# Altium project miniBackplane_SFP.PrjPCB (part 2 of 2)

## Sheet WR_LINK.SchDoc
size A3 portrait
Used 9 times, as channels U_WR_LINK, U_WR_LINK, U_WR_LINK, U_WR_LINK, U_WR_LINK, U_WR_LINK, U_WR_LINK, U_WR_LINK, U_WR_LINK. Parts and nets are listed once, with the designators drawn on the sheet.
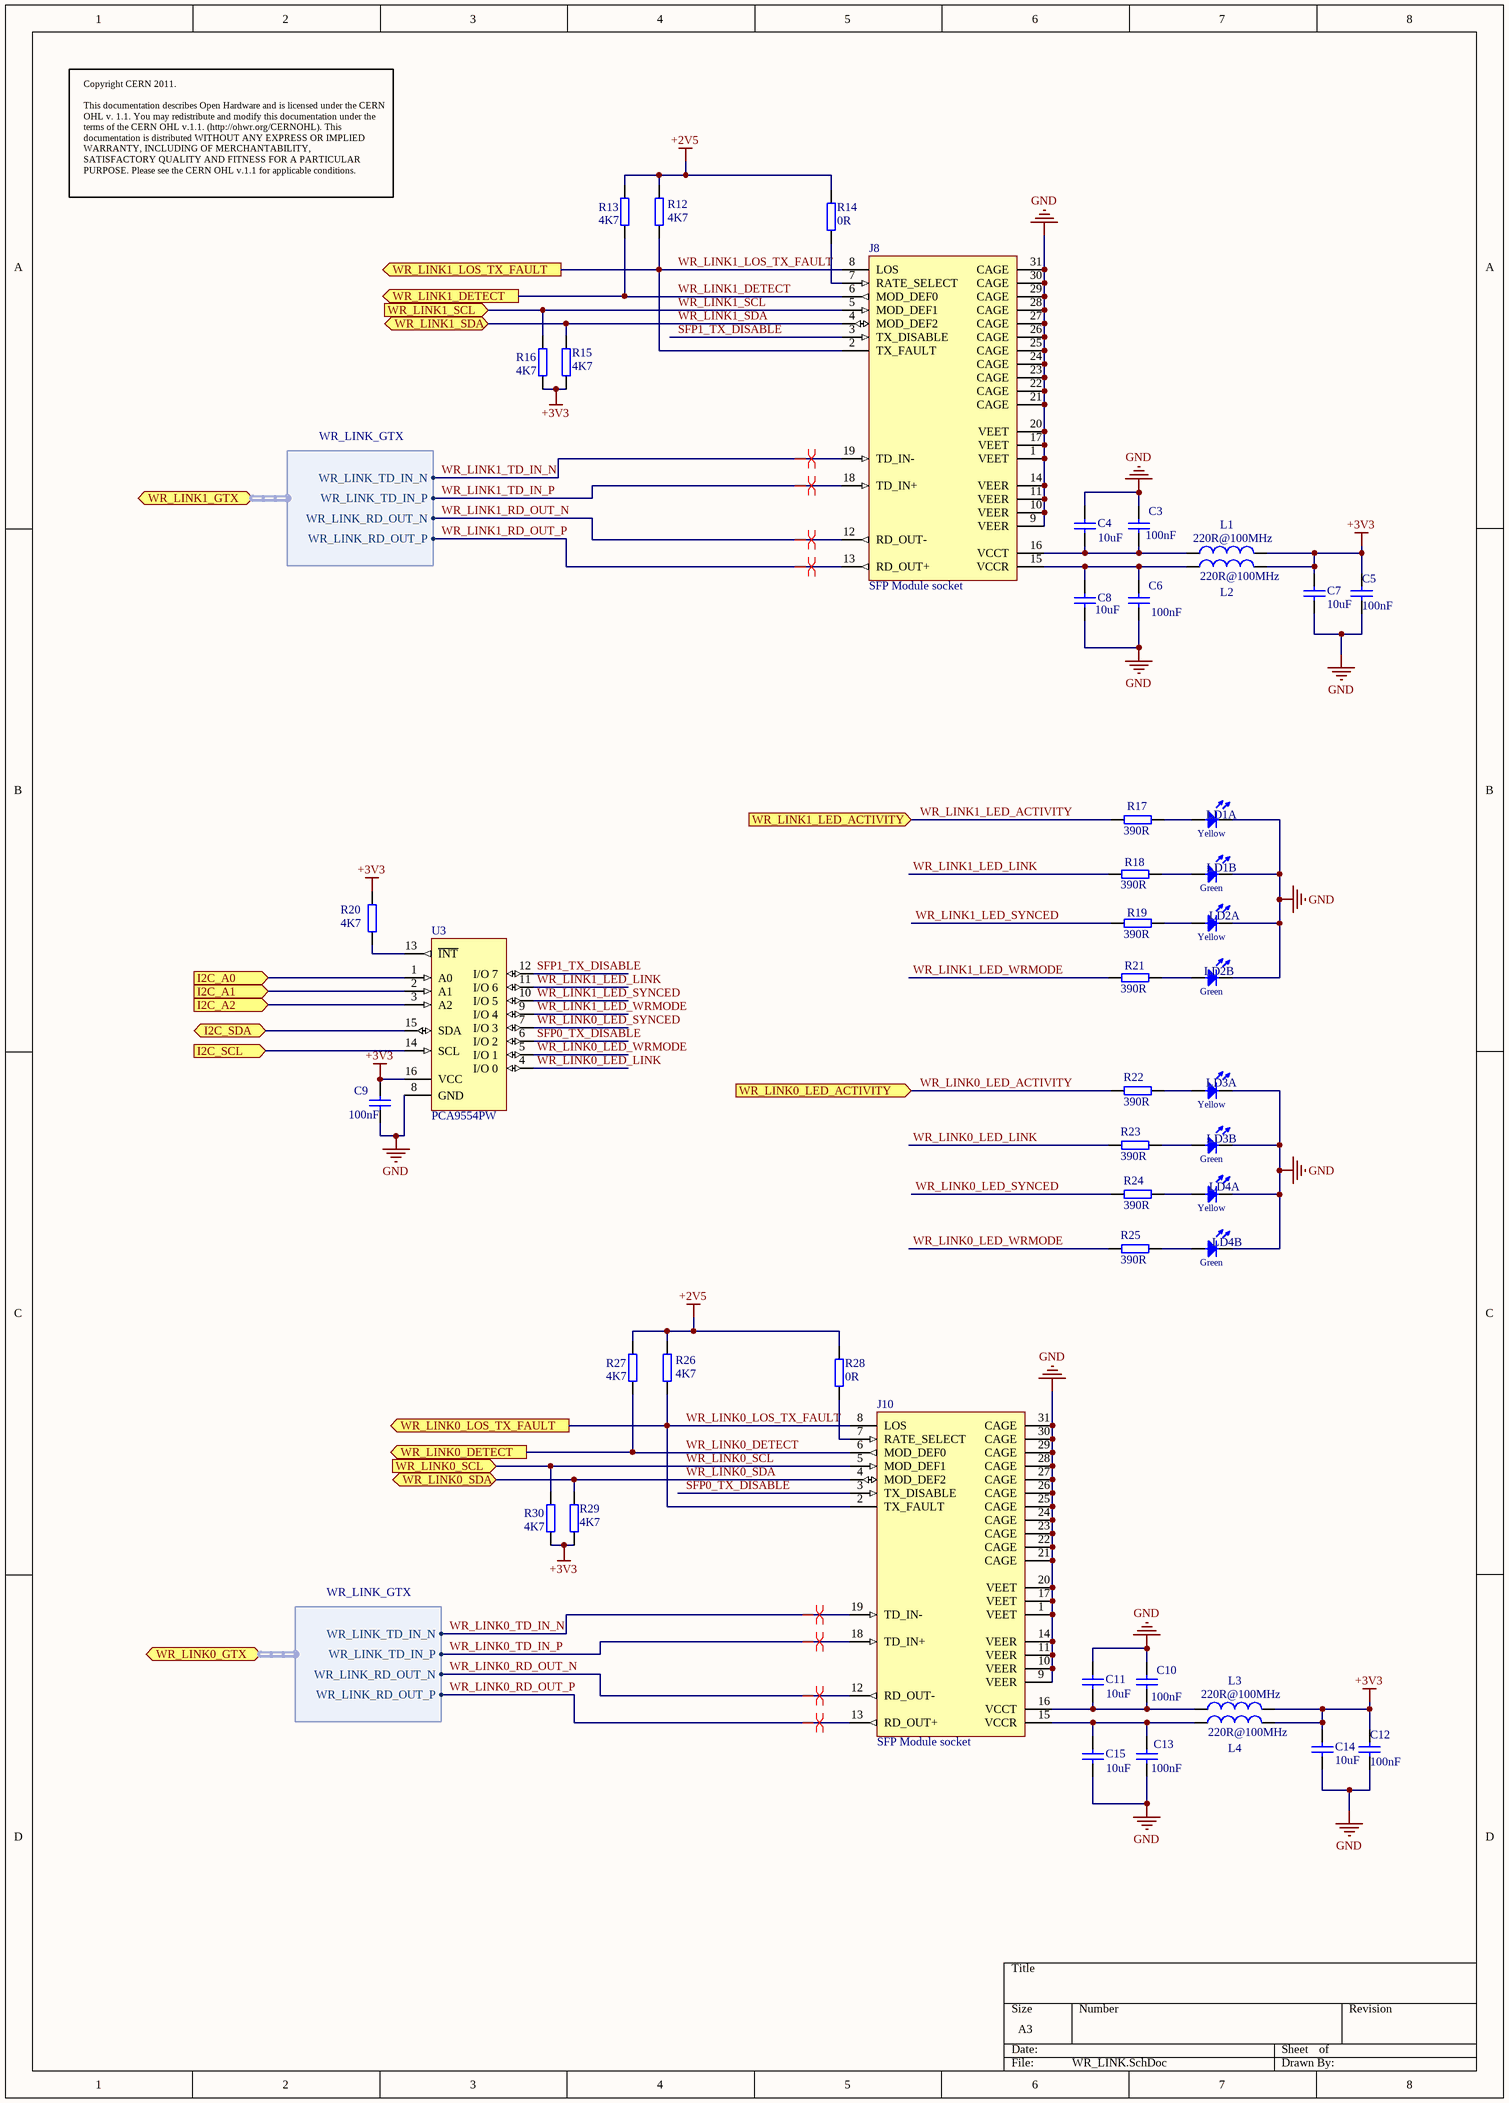
[diagram p6: WR_LINK.SchDoc]

### Parts
C3  100nF  [CC1608-0603]
C4  10uF  [CC2012-0805]
C5  100nF  [CC1608-0603]
C6  100nF  [CC1608-0603]
C7  10uF  [CC1608-0603]
C8  10uF  [CC2012-0805]
C9  100nF  [CC1608-0603]
C10  100nF  [CC1608-0603]
C11  10uF  [CC2012-0805]
C12  100nF  [CC1608-0603]
C13  100nF  [CC1608-0603]
C14  10uF  [CC1608-0603]
C15  10uF  [CC2012-0805]
J8  SFP Module socket  [SFP_SINGLE_PORT]
J10  SFP Module socket  [SFP_SINGLE_PORT]
L1  Impedance: 220R@100MHz  [0603]  (hidden comment: 220R@100MHz Ferrite Bead)
L2  Impedance: 220R@100MHz  [0603]  (hidden comment: 220R@100MHz Ferrite Bead)
L3  Impedance: 220R@100MHz  [0603]  (hidden comment: 220R@100MHz Ferrite Bead)
L4  Impedance: 220R@100MHz  [0603]  (hidden comment: 220R@100MHz Ferrite Bead)
LD1  Green/Yellow  [LED_DIALIGHT_591-3x0x-0xx]  (value not drawn)  (parts A,B of 2)
LD2  Green/Yellow  [LED_DIALIGHT_591-3x0x-0xx]  (value not drawn)  (parts A,B of 2)
LD3  Green/Yellow  [LED_DIALIGHT_591-3x0x-0xx]  (value not drawn)  (parts A,B of 2)
LD4  Green/Yellow  [LED_DIALIGHT_591-3x0x-0xx]  (value not drawn)  (parts A,B of 2)
R12  4K7  [0603]
R13  4K7  [0603]
R14  0R  [0603]
R15  4K7  [0603]
R16  4K7  [0603]
R17  390R  [0603]
R18  390R  [0603]
R19  390R  [0603]
R20  4K7  [0603]
R21  390R  [0603]
R22  390R  [0603]
R23  390R  [0603]
R24  390R  [0603]
R25  390R  [0603]
R26  4K7  [0603]
R27  4K7  [0603]
R28  0R  [0603]
R29  4K7  [0603]
R30  4K7  [0603]
U3  PCA9554PW  [SOP65P640X120-16N]

### Ports
I2C_A0 (in), I2C_A1 (in), I2C_A2 (in), I2C_SCL (in), I2C_SDA (bidir), WR_LINK0_DETECT (out), WR_LINK0_GTX (harness WR_LINK_GTX), WR_LINK0_LED_ACTIVITY (in), WR_LINK0_LOS_TX_FAULT (out), WR_LINK0_SCL (in), WR_LINK0_SDA (bidir), WR_LINK1_DETECT (out), WR_LINK1_GTX (harness WR_LINK_GTX), WR_LINK1_LED_ACTIVITY (in), WR_LINK1_LOS_TX_FAULT (out), WR_LINK1_SCL (in), WR_LINK1_SDA (bidir)

### Harnesses
WR_LINK_GTX: WR_LINK_TD_IN_N, WR_LINK_TD_IN_P, WR_LINK_RD_OUT_N, WR_LINK_RD_OUT_P

### Nets
+2V5: R12.2 R13.2 R14.1 R26.2 R27.2 R28.1
+3V3: C5.1 C7.1 C9.1 C12.1 C14.1 L1.2 L2.2 L3.2 L4.2 R15.2 R16.2 R20.2 R29.2 R30.2 U3.16(VCC)
GND: C3.1 C4.2 C5.2 C6.2 C7.2 C8.1 C9.2 C10.1 C11.2 C12.2 C13.2 C14.2 C15.1 J8.1(VEET) J8.9(VEER) J8.10(VEER) J8.11(VEER) J8.14(VEER) J8.17(VEET) J8.20(VEET) J8.21(CAGE) J8.22(CAGE) J8.23(CAGE) J8.24(CAGE) J8.25(CAGE) J8.26(CAGE) J8.27(CAGE) J8.28(CAGE) J8.29(CAGE) J8.30(CAGE) J8.31(CAGE) J10.1(VEET) J10.9(VEER) J10.10(VEER) J10.11(VEER) J10.14(VEER) J10.17(VEET) J10.20(VEET) J10.21(CAGE) J10.22(CAGE) J10.23(CAGE) J10.24(CAGE) J10.25(CAGE) J10.26(CAGE) J10.27(CAGE) J10.28(CAGE) J10.29(CAGE) J10.30(CAGE) J10.31(CAGE) LD1.1(C) LD1.4(C) LD2.1(C) LD2.4(C) LD3.1(C) LD3.4(C) LD4.1(C) LD4.4(C) U3.8(GND)
I2C_A0: U3.1(A0) ; port I2C_A0
I2C_A1: U3.2(A1) ; port I2C_A1
I2C_A2: U3.3(A2) ; port I2C_A2
I2C_SCL: U3.14(SCL) ; port I2C_SCL
I2C_SDA: U3.15(SDA) ; port I2C_SDA
SFP0_TX_DISABLE: J10.3(TX_DISABLE) U3.6(I/O_2)
SFP1_TX_DISABLE: J8.3(TX_DISABLE) U3.12(I/O_7)
WR_LINK0_DETECT: J10.6(MOD_DEF0) R27.1 ; port WR_LINK0_DETECT
WR_LINK0_LED_ACTIVITY: R22.2 ; port WR_LINK0_LED_ACTIVITY
WR_LINK0_LED_LINK: R23.2 U3.4(I/O_0)
WR_LINK0_LED_SYNCED: R24.2 U3.7(I/O_3)
WR_LINK0_LED_WRMODE: R25.2 U3.5(I/O_1)
WR_LINK0_LOS_TX_FAULT: J10.2(TX_FAULT) J10.8(LOS) R26.1 ; port WR_LINK0_LOS_TX_FAULT
WR_LINK0_RD_OUT_N: J10.12(RD_OUT-) ; port WR_LINK0_GTX.WR_LINK_RD_OUT_N
WR_LINK0_RD_OUT_P: J10.13(RD_OUT+) ; port WR_LINK0_GTX.WR_LINK_RD_OUT_P
WR_LINK0_SCL: J10.5(MOD_DEF1) R30.1 ; port WR_LINK0_SCL
WR_LINK0_SDA: J10.4(MOD_DEF2) R29.1 ; port WR_LINK0_SDA
WR_LINK0_TD_IN_N: J10.19(TD_IN-) ; port WR_LINK0_GTX.WR_LINK_TD_IN_N
WR_LINK0_TD_IN_P: J10.18(TD_IN+) ; port WR_LINK0_GTX.WR_LINK_TD_IN_P
WR_LINK1_DETECT: J8.6(MOD_DEF0) R13.1 ; port WR_LINK1_DETECT
WR_LINK1_LED_ACTIVITY: R17.2 ; port WR_LINK1_LED_ACTIVITY
WR_LINK1_LED_LINK: R18.2 U3.11(I/O_6)
WR_LINK1_LED_SYNCED: R19.2 U3.10(I/O_5)
WR_LINK1_LED_WRMODE: R21.2 U3.9(I/O_4)
WR_LINK1_LOS_TX_FAULT: J8.2(TX_FAULT) J8.8(LOS) R12.1 ; port WR_LINK1_LOS_TX_FAULT
WR_LINK1_RD_OUT_N: J8.12(RD_OUT-) ; port WR_LINK1_GTX.WR_LINK_RD_OUT_N
WR_LINK1_RD_OUT_P: J8.13(RD_OUT+) ; port WR_LINK1_GTX.WR_LINK_RD_OUT_P
WR_LINK1_SCL: J8.5(MOD_DEF1) R16.1 ; port WR_LINK1_SCL
WR_LINK1_SDA: J8.4(MOD_DEF2) R15.1 ; port WR_LINK1_SDA
WR_LINK1_TD_IN_N: J8.19(TD_IN-) ; port WR_LINK1_GTX.WR_LINK_TD_IN_N
WR_LINK1_TD_IN_P: J8.18(TD_IN+) ; port WR_LINK1_GTX.WR_LINK_TD_IN_P
NetC3_2: C3.2 C4.1 J8.16(VCCT) L1.1
NetC6_1: C6.1 C8.2 J8.15(VCCR) L2.1
NetC10_2: C10.2 C11.1 J10.16(VCCT) L3.1
NetC13_1: C13.1 C15.2 J10.15(VCCR) L4.1
NetJ8_7: J8.7(RATE_SELECT) R14.2
NetJ10_7: J10.7(RATE_SELECT) R28.2
NetLD1_2: LD1.2(A) R17.1
NetLD1_3: LD1.3(A) R18.1
NetLD2_2: LD2.2(A) R19.1
NetLD2_3: LD2.3(A) R21.1
NetLD3_2: LD3.2(A) R22.1
NetLD3_3: LD3.3(A) R23.1
NetLD4_2: LD4.2(A) R24.1
NetLD4_3: LD4.3(A) R25.1
NetR20_1: R20.1 U3.13(~{INT})

### Channels
U_WR_LINK: designators end in _U_WR_LINK#1; ports I2C_A0=GND I2C_A1=GND I2C_A2=GND I2C_SCL=FPGA-GPIO39 I2C_SDA=FPGA-GPIO38 WR_LINK0_DETECT=ARM_2V5_GPIO_PE0 WR_LINK0_LED_ACTIVITY=FPGA-GPIO33 WR_LINK0_LOS_TX_FAULT=FPGA-GPIO10 WR_LINK0_SCL=I2C_DL_SC0 WR_LINK0_SDA=I2C_DL_SD0 WR_LINK1_DETECT=ARM_2V5_GPIO_PE1 WR_LINK1_LED_ACTIVITY=FPGA-GPIO34 WR_LINK1_LOS_TX_FAULT=FPGA-GPIO35 WR_LINK1_SCL=I2C_DL_SC1 WR_LINK1_SDA=I2C_DL_SD1
U_WR_LINK: designators end in _U_WR_LINK#2; ports I2C_A0=+3V3 I2C_A1=GND I2C_A2=GND I2C_SCL=FPGA-GPIO39 I2C_SDA=FPGA-GPIO38 WR_LINK0_DETECT=ARM_2V5_GPIO_PE2 WR_LINK0_LED_ACTIVITY=FPGA-GPIO30 WR_LINK0_LOS_TX_FAULT=FPGA-GPIO9 WR_LINK0_SCL=I2C_DL_SC2 WR_LINK0_SDA=I2C_DL_SD2 WR_LINK1_DETECT=ARM_2V5_GPIO_PE3 WR_LINK1_LED_ACTIVITY=FPGA-GPIO31 WR_LINK1_LOS_TX_FAULT=FPGA-GPIO32 WR_LINK1_SCL=I2C_DL_SC3 WR_LINK1_SDA=I2C_DL_SD3
U_WR_LINK: designators end in _U_WR_LINK#3; ports I2C_A0=GND I2C_A1=+3V3 I2C_A2=GND I2C_SCL=FPGA-GPIO39 I2C_SDA=FPGA-GPIO38 WR_LINK0_DETECT=ARM_2V5_GPIO_PE4 WR_LINK0_LED_ACTIVITY=FPGA-GPIO27 WR_LINK0_LOS_TX_FAULT=FPGA-GPIO8 WR_LINK0_SCL=I2C_DL_SC4 WR_LINK0_SDA=I2C_DL_SD4 WR_LINK1_DETECT=ARM_2V5_GPIO_PE5 WR_LINK1_LED_ACTIVITY=FPGA-GPIO28 WR_LINK1_LOS_TX_FAULT=FPGA-GPIO29 WR_LINK1_SCL=I2C_DL_SC5 WR_LINK1_SDA=I2C_DL_SD5
U_WR_LINK: designators end in _U_WR_LINK#4; ports I2C_A0=+3V3 I2C_A1=+3V3 I2C_A2=GND I2C_SCL=FPGA-GPIO39 I2C_SDA=FPGA-GPIO38 WR_LINK0_DETECT=ARM_2V5_GPIO_PE6 WR_LINK0_LED_ACTIVITY=FPGA-GPIO24 WR_LINK0_LOS_TX_FAULT=FPGA-GPIO7 WR_LINK0_SCL=I2C_DL_SC6 WR_LINK0_SDA=I2C_DL_SD6 WR_LINK1_DETECT=ARM_2V5_GPIO_PE7 WR_LINK1_LED_ACTIVITY=FPGA-GPIO25 WR_LINK1_LOS_TX_FAULT=FPGA-GPIO26 WR_LINK1_SCL=I2C_DL_SC7 WR_LINK1_SDA=I2C_DL_SD7
U_WR_LINK: designators end in _U_WR_LINK#5; ports I2C_A0=GND I2C_A1=GND I2C_A2=+3V3 I2C_SCL=FPGA-GPIO39 I2C_SDA=FPGA-GPIO38 WR_LINK0_DETECT=ARM_2V5_GPIO_PE8 WR_LINK0_LED_ACTIVITY=FPGA-GPIO21 WR_LINK0_LOS_TX_FAULT=FPGA-GPIO6 WR_LINK0_SCL=I2C_DL_SC8 WR_LINK0_SDA=I2C_DL_SD8 WR_LINK1_DETECT=ARM_2V5_GPIO_PE9 WR_LINK1_LED_ACTIVITY=FPGA-GPIO22 WR_LINK1_LOS_TX_FAULT=FPGA-GPIO23 WR_LINK1_SCL=I2C_DL_SC9 WR_LINK1_SDA=I2C_DL_SD9
U_WR_LINK: designators end in _U_WR_LINK#6; ports I2C_A0=+3V3 I2C_A1=GND I2C_A2=+3V3 I2C_SCL=FPGA-GPIO39 I2C_SDA=FPGA-GPIO38 WR_LINK0_DETECT=ARM_2V5_GPIO_PE10 WR_LINK0_LED_ACTIVITY=FPGA-GPIO18 WR_LINK0_LOS_TX_FAULT=FPGA-GPIO5 WR_LINK0_SCL=I2C_DL_SC10 WR_LINK0_SDA=I2C_DL_SD10 WR_LINK1_DETECT=ARM_2V5_GPIO_PE11 WR_LINK1_LED_ACTIVITY=FPGA-GPIO19 WR_LINK1_LOS_TX_FAULT=FPGA-GPIO20 WR_LINK1_SCL=I2C_DL_SC11 WR_LINK1_SDA=I2C_DL_SD11
U_WR_LINK: designators end in _U_WR_LINK#7; ports I2C_A0=GND I2C_A1=+3V3 I2C_A2=+3V3 I2C_SCL=FPGA-GPIO39 I2C_SDA=FPGA-GPIO38 WR_LINK0_DETECT=ARM_2V5_GPIO_PE12 WR_LINK0_LED_ACTIVITY=FPGA-GPIO15 WR_LINK0_LOS_TX_FAULT=FPGA-GPIO4 WR_LINK0_SCL=I2C_DL_SC12 WR_LINK0_SDA=I2C_DL_SD12 WR_LINK1_DETECT=ARM_2V5_GPIO_PE13 WR_LINK1_LED_ACTIVITY=FPGA-GPIO16 WR_LINK1_LOS_TX_FAULT=FPGA-GPIO17 WR_LINK1_SCL=I2C_DL_SC13 WR_LINK1_SDA=I2C_DL_SD13
U_WR_LINK: designators end in _U_WR_LINK#8; ports I2C_A0=+3V3 I2C_A1=+3V3 I2C_A2=+3V3 I2C_SCL=FPGA-GPIO39 I2C_SDA=FPGA-GPIO38 WR_LINK0_DETECT=ARM_2V5_GPIO_PE14 WR_LINK0_LED_ACTIVITY=FPGA-GPIO12 WR_LINK0_LOS_TX_FAULT=FPGA-GPIO3 WR_LINK0_SCL=I2C_DL_SC14 WR_LINK0_SDA=I2C_DL_SD14 WR_LINK1_DETECT=ARM_2V5_GPIO_PE15 WR_LINK1_LED_ACTIVITY=FPGA-GPIO13 WR_LINK1_LOS_TX_FAULT=FPGA-GPIO14 WR_LINK1_SCL=I2C_DL_SC15 WR_LINK1_SDA=I2C_DL_SD15
U_WR_LINK: designators end in _U_WR_LINK#9; ports I2C_A0=GND I2C_A1=GND I2C_A2=GND I2C_SCL=FPGA-GPIO37 I2C_SDA=FPGA-GPIO36 WR_LINK0_DETECT=ARM_2V5_GPIO_PD11 WR_LINK0_LED_ACTIVITY=FPGA-GPIO1 WR_LINK0_LOS_TX_FAULT=FPGA-GPIO0 WR_LINK0_SCL=ARM_3V3_GPIO_PB3 WR_LINK0_SDA=ARM_3V3_GPIO_PB2 WR_LINK1_DETECT=ARM_2V5_GPIO_PD10 WR_LINK1_LED_ACTIVITY=FPGA-GPIO2 WR_LINK1_LOS_TX_FAULT=FPGA-GPIO11 WR_LINK1_SCL=ARM_3V3_GPIO_PB5 WR_LINK1_SDA=ARM_3V3_GPIO_PB4

### Layout directives
differential pair: MGTRX112_0_N, MGTRX112_0_P, MGTRX112_1_N, MGTRX112_1_P, MGTTX112_0_N, MGTTX112_0_P, MGTTX112_1_N, MGTTX112_1_P

### Notes on the sheet
- Copyright CERN 2011.
  This documentation describes Open Hardware and is licensed under the CERN OHL v. 1.1. You may redistribute and modify this documentation under the terms of the CERN OHL v.1.1. (http://ohwr.org/CERNOHL). This documentation is distributed WITHOUT ANY EXPRESS OR IMPLIED WARRANTY, INCLUDING OF MERCHANTABILITY, SATISFACTORY QUALITY AND FITNESS FOR A PARTICULAR PURPOSE. Please see the CERN OHL v.1.1 for applicable conditions.
- (in symbol LED_DIALIGHT_591-3x0x, part A) Yellow
- (in symbol LED_DIALIGHT_591-3x0x, part B) Green

### Library data of the parts
C3 C5 C6 C9 C10 C12 C13 = CC0603_100NF_16V_10%_X7R: Capacitor; Manufacturer1: AVX; Manufacturer1 PN: 0603YC104KAT2A; TC: X7R; Tolerance: ±10%; Voltage: 16V; Published: 8-Jun-2000; LatestRevisionDate: 17-Jul-2002; LatestRevisionNote: Re-released for DXP Platform.; PackageReference: RAD-0.3; Publisher: Altium Limited; Distributor1: Digikey; Distributor1 PN: 478-1239-1-ND; Case: 0603; Value: 100nF
C4 C8 C11 C15 = CC0805_10UF_16V_10%_X5R: Capacitor; Manufacturer1: Murata; Manufacturer1 PN: GRM21BR61A106KE19L; TC: X5R; Tolerance: ±10%; Voltage: 16V; Published: 8-Jun-2000; LatestRevisionDate: 17-Jul-2002; LatestRevisionNote: Re-released for DXP Platform.; PackageReference: RAD-0.3; Publisher: Altium Limited; Distributor1: Digikey; Distributor1 PN: 490-1709-1-ND; Case: 0805; Value: 10uF
C7 C14 = CC0603_10UF_6.3V_20%_X5R: Capacitor; Manufacturer1: TDK; Manufacturer1 PN: C1608X5R0J106M; TC: X5R; Tolerance: ±20%; Voltage: 6.3V; Published: 8-Jun-2000; LatestRevisionDate: 17-Jul-2002; LatestRevisionNote: Re-released for DXP Platform.; PackageReference: RAD-0.3; Publisher: Altium Limited; Distributor1: Digikey; Distributor1 PN: 445-4112-1-ND; Case: 0603; Value: 10uF
J8 J10 = SFP_SOCKET_SINGLE: Socket for SFP module; Manufacturer1 PN: UE75A203000T; Manufacturer1: Amphenol; Distributor1 PN: 1256176; Distributor1: Farnell
L1-L4 = L_FERRITE_BEAD: ferrite bead; Manufacturer1: Murata; Manufacturer1 PN: BLM18KG221SN1D; Current Rating: 2.2A; DCR: 50mOhm; Case: 0603; Distributor1: Digikey; Distributor1 PN: 490-5255-1-ND
LD1-LD4 = LED_DIALIGHT_591-3x0x: Bi-Color LED SMD; Manufacturer1 PN: 591-3101-013F; Color: Green/Yellow; Footprint: LED_DIALIGHT_571-0132F; Manufacturer1: DIALIGHT; ComponentHeight: 5mm; Distributor1: Digikey; Distributor1 PN: 350-1790-1-ND
R12 R13 R15 R16 R20 R26 R27 R29 R30 = R0603_4.7K_±1%_0.1W_100PPM: SMD Resistor; Manufacturer1: Panasonic; Manufacturer1 PN: ERJ-3EKF4701V; TCR: 100ppm; Power Rating: 0.1W; Tolerance: ±1%; Case: 0603; Distributor1: DigiKey; Distributor1 PN: P4.70KHCT-ND; Value: 4K7
R14 R28 = R0603_0R_0.1W_JUMPER: SMD Resistor; Manufacturer1: Yageo; Manufacturer1 PN: RC0603JR-070RL; TCR: 200ppm; Power Rating: 0.1W; Case: 0603; Distributor1: DigiKey; Distributor1 PN: 311-0.0GRCT-ND; Tolerance: -; Value: 0R
R17-R19 R21-R25 = R0603_390R_±1%_0.1W_100PPM: SMD Resistor; Manufacturer1: Panasonic; Manufacturer1 PN: ERJ-3EKF3900V; TCR: 100ppm; Power Rating: 0.1W; Tolerance: ±1%; Case: 0603; Distributor1: DigiKey; Distributor1 PN: P390HCT-ND; Value: 390R
U3 = PCA9554D: 8-bit I2C-bus SMBus I/O port with interrupt; Manufacturer1 PN: PCA9554PW,112; Manufacturer1: NXP Semiconductors; Distributor1: Digikey; Distributor1 PN: 568-3984-5-ND

## Nets that join several sheets
+2V5: Main (R8.2 R9.1 R10.2 R11.1), Connector_GTX (J1.81), Power_Supply (IC4.10), Connectors_GPIOs (R1.1 R2.1 R43.1), U_WR_LINK (6 pins), U_WR_LINK (6 pins), U_WR_LINK (6 pins), U_WR_LINK (6 pins), U_WR_LINK (6 pins), U_WR_LINK (6 pins), U_WR_LINK (6 pins), U_WR_LINK (6 pins), U_WR_LINK (6 pins)
+3V3: I2C_Multiplexers (11 pins), Power_Supply (9 pins), TEST_USB (C56.2 IC8.1 R31.2 R32.2), U_WR_LINK (15 pins), U_WR_LINK (16 pins), U_WR_LINK (16 pins), U_WR_LINK (17 pins), U_WR_LINK (16 pins), U_WR_LINK (17 pins), U_WR_LINK (17 pins), U_WR_LINK (18 pins), U_WR_LINK (15 pins)
+5V: Power_Supply (9 pins), Connectors_GPIOs (13 pins)
+12VCC_IN: Power_Supply (13 pins), Connectors_GPIOs (6 pins)
GND: Main (15 pins), Connector_GTX (12 pins), I2C_Multiplexers (12 pins), Power_Supply (32 pins), TEST_USB (12 pins), Connectors_GPIOs (28 pins), U_WR_LINK (61 pins), U_WR_LINK (60 pins), U_WR_LINK (60 pins), U_WR_LINK (59 pins), U_WR_LINK (60 pins), U_WR_LINK (59 pins), U_WR_LINK (59 pins), U_WR_LINK (58 pins), U_WR_LINK (61 pins)
ARM_2V5_GPIO_PD10: Connectors_GPIOs (J2.41), U_WR_LINK (J8_U_WR_LINK#9.6 R13_U_WR_LINK#9.1)
ARM_2V5_GPIO_PD11: Connectors_GPIOs (J2.19), U_WR_LINK (J10_U_WR_LINK#9.6 R27_U_WR_LINK#9.1)
ARM_2V5_GPIO_PD12: I2C_Multiplexers (IC5.3 IC6.3 R5.1), Connectors_GPIOs (J2.75)
ARM_2V5_GPIO_PE0: Connectors_GPIOs (J2.39), U_WR_LINK (J10_U_WR_LINK#1.6 R27_U_WR_LINK#1.1)
ARM_2V5_GPIO_PE1: Connectors_GPIOs (J2.73), U_WR_LINK (J8_U_WR_LINK#1.6 R13_U_WR_LINK#1.1)
ARM_2V5_GPIO_PE2: Connectors_GPIOs (J2.37), U_WR_LINK (J10_U_WR_LINK#2.6 R27_U_WR_LINK#2.1)
ARM_2V5_GPIO_PE3: Connectors_GPIOs (J2.71), U_WR_LINK (J8_U_WR_LINK#2.6 R13_U_WR_LINK#2.1)
ARM_2V5_GPIO_PE4: Connectors_GPIOs (J2.35), U_WR_LINK (J10_U_WR_LINK#3.6 R27_U_WR_LINK#3.1)
ARM_2V5_GPIO_PE5: Connectors_GPIOs (J2.69), U_WR_LINK (J8_U_WR_LINK#3.6 R13_U_WR_LINK#3.1)
ARM_2V5_GPIO_PE6: Connectors_GPIOs (J2.33), U_WR_LINK (J10_U_WR_LINK#4.6 R27_U_WR_LINK#4.1)
ARM_2V5_GPIO_PE7: Connectors_GPIOs (J2.67), U_WR_LINK (J8_U_WR_LINK#4.6 R13_U_WR_LINK#4.1)
ARM_2V5_GPIO_PE8: Connectors_GPIOs (J2.25), U_WR_LINK (J10_U_WR_LINK#5.6 R27_U_WR_LINK#5.1)
ARM_2V5_GPIO_PE9: Connectors_GPIOs (J2.65), U_WR_LINK (J8_U_WR_LINK#5.6 R13_U_WR_LINK#5.1)
ARM_2V5_GPIO_PE10: Connectors_GPIOs (J2.23), U_WR_LINK (J10_U_WR_LINK#6.6 R27_U_WR_LINK#6.1)
ARM_2V5_GPIO_PE11: Connectors_GPIOs (J2.47), U_WR_LINK (J8_U_WR_LINK#6.6 R13_U_WR_LINK#6.1)
ARM_2V5_GPIO_PE12: Connectors_GPIOs (J2.21), U_WR_LINK (J10_U_WR_LINK#7.6 R27_U_WR_LINK#7.1)
ARM_2V5_GPIO_PE13: Connectors_GPIOs (J2.45), U_WR_LINK (J8_U_WR_LINK#7.6 R13_U_WR_LINK#7.1)
ARM_2V5_GPIO_PE14: Connectors_GPIOs (J2.17), U_WR_LINK (J10_U_WR_LINK#8.6 R27_U_WR_LINK#8.1)
ARM_2V5_GPIO_PE15: Connectors_GPIOs (J2.43), U_WR_LINK (J8_U_WR_LINK#8.6 R13_U_WR_LINK#8.1)
ARM_3V3_GPIO_PB0: I2C_Multiplexers (IC5.23 IC6.23 IC7.6 R7.2), Connectors_GPIOs (J2.63)
ARM_3V3_GPIO_PB1: I2C_Multiplexers (IC5.22 IC6.22 IC7.1 R6.2), Connectors_GPIOs (J2.61)
ARM_3V3_GPIO_PB2: Connectors_GPIOs (J2.51), U_WR_LINK (J10_U_WR_LINK#9.4 R29_U_WR_LINK#9.1)
ARM_3V3_GPIO_PB3: Connectors_GPIOs (J2.49), U_WR_LINK (J10_U_WR_LINK#9.5 R30_U_WR_LINK#9.1)
ARM_3V3_GPIO_PB4: Connectors_GPIOs (J2.55), U_WR_LINK (J8_U_WR_LINK#9.4 R15_U_WR_LINK#9.1)
ARM_3V3_GPIO_PB5: Connectors_GPIOs (J2.53), U_WR_LINK (J8_U_WR_LINK#9.5 R16_U_WR_LINK#9.1)
FPGA-GPIO0: Connectors_GPIOs (J2.2), U_WR_LINK (J10_U_WR_LINK#9.2 J10_U_WR_LINK#9.8 R26_U_WR_LINK#9.1)
FPGA-GPIO1: Connectors_GPIOs (J2.4), U_WR_LINK (R22_U_WR_LINK#9.2)
FPGA-GPIO2: Connectors_GPIOs (J2.6), U_WR_LINK (R17_U_WR_LINK#9.2)
FPGA-GPIO3: Connectors_GPIOs (J2.8), U_WR_LINK (J10_U_WR_LINK#8.2 J10_U_WR_LINK#8.8 R26_U_WR_LINK#8.1)
FPGA-GPIO4: Connectors_GPIOs (J2.10), U_WR_LINK (J10_U_WR_LINK#7.2 J10_U_WR_LINK#7.8 R26_U_WR_LINK#7.1)
FPGA-GPIO5: Connectors_GPIOs (J2.12), U_WR_LINK (J10_U_WR_LINK#6.2 J10_U_WR_LINK#6.8 R26_U_WR_LINK#6.1)
FPGA-GPIO6: Connectors_GPIOs (J2.14), U_WR_LINK (J10_U_WR_LINK#5.2 J10_U_WR_LINK#5.8 R26_U_WR_LINK#5.1)
FPGA-GPIO7: Connectors_GPIOs (J2.16), U_WR_LINK (J10_U_WR_LINK#4.2 J10_U_WR_LINK#4.8 R26_U_WR_LINK#4.1)
FPGA-GPIO8: Connectors_GPIOs (J2.18), U_WR_LINK (J10_U_WR_LINK#3.2 J10_U_WR_LINK#3.8 R26_U_WR_LINK#3.1)
FPGA-GPIO9: Connectors_GPIOs (J2.20), U_WR_LINK (J10_U_WR_LINK#2.2 J10_U_WR_LINK#2.8 R26_U_WR_LINK#2.1)
FPGA-GPIO10: Connectors_GPIOs (J2.22), U_WR_LINK (J10_U_WR_LINK#1.2 J10_U_WR_LINK#1.8 R26_U_WR_LINK#1.1)
FPGA-GPIO11: Connectors_GPIOs (J2.24), U_WR_LINK (J8_U_WR_LINK#9.2 J8_U_WR_LINK#9.8 R12_U_WR_LINK#9.1)
FPGA-GPIO12: Connectors_GPIOs (J2.26), U_WR_LINK (R22_U_WR_LINK#8.2)
FPGA-GPIO13: Connectors_GPIOs (J2.28), U_WR_LINK (R17_U_WR_LINK#8.2)
FPGA-GPIO14: Connectors_GPIOs (J2.30), U_WR_LINK (J8_U_WR_LINK#8.2 J8_U_WR_LINK#8.8 R12_U_WR_LINK#8.1)
FPGA-GPIO15: Connectors_GPIOs (J2.32), U_WR_LINK (R22_U_WR_LINK#7.2)
FPGA-GPIO16: Connectors_GPIOs (J2.34), U_WR_LINK (R17_U_WR_LINK#7.2)
FPGA-GPIO17: Connectors_GPIOs (J2.36), U_WR_LINK (J8_U_WR_LINK#7.2 J8_U_WR_LINK#7.8 R12_U_WR_LINK#7.1)
FPGA-GPIO18: Connectors_GPIOs (J2.38), U_WR_LINK (R22_U_WR_LINK#6.2)
FPGA-GPIO19: Connectors_GPIOs (J2.40), U_WR_LINK (R17_U_WR_LINK#6.2)
FPGA-GPIO20: Connectors_GPIOs (J2.42), U_WR_LINK (J8_U_WR_LINK#6.2 J8_U_WR_LINK#6.8 R12_U_WR_LINK#6.1)
FPGA-GPIO21: Connectors_GPIOs (J2.44), U_WR_LINK (R22_U_WR_LINK#5.2)
FPGA-GPIO22: Connectors_GPIOs (J2.46), U_WR_LINK (R17_U_WR_LINK#5.2)
FPGA-GPIO23: Connectors_GPIOs (J2.48), U_WR_LINK (J8_U_WR_LINK#5.2 J8_U_WR_LINK#5.8 R12_U_WR_LINK#5.1)
FPGA-GPIO24: Connectors_GPIOs (J2.50), U_WR_LINK (R22_U_WR_LINK#4.2)
FPGA-GPIO25: Connectors_GPIOs (J2.52), U_WR_LINK (R17_U_WR_LINK#4.2)
FPGA-GPIO26: Connectors_GPIOs (J2.54), U_WR_LINK (J8_U_WR_LINK#4.2 J8_U_WR_LINK#4.8 R12_U_WR_LINK#4.1)
FPGA-GPIO27: Connectors_GPIOs (J2.56), U_WR_LINK (R22_U_WR_LINK#3.2)
FPGA-GPIO28: Connectors_GPIOs (J2.58), U_WR_LINK (R17_U_WR_LINK#3.2)
FPGA-GPIO29: Connectors_GPIOs (J2.60), U_WR_LINK (J8_U_WR_LINK#3.2 J8_U_WR_LINK#3.8 R12_U_WR_LINK#3.1)
FPGA-GPIO30: Connectors_GPIOs (J2.62), U_WR_LINK (R22_U_WR_LINK#2.2)
FPGA-GPIO31: Connectors_GPIOs (J2.64), U_WR_LINK (R17_U_WR_LINK#2.2)
FPGA-GPIO32: Connectors_GPIOs (J2.66), U_WR_LINK (J8_U_WR_LINK#2.2 J8_U_WR_LINK#2.8 R12_U_WR_LINK#2.1)
FPGA-GPIO33: Connectors_GPIOs (J2.68), U_WR_LINK (R22_U_WR_LINK#1.2)
FPGA-GPIO34: Connectors_GPIOs (J2.70), U_WR_LINK (R17_U_WR_LINK#1.2)
FPGA-GPIO35: Connectors_GPIOs (J2.72), U_WR_LINK (J8_U_WR_LINK#1.2 J8_U_WR_LINK#1.8 R12_U_WR_LINK#1.1)
FPGA-GPIO36: Main (R11.2), Connectors_GPIOs (J2.74), U_WR_LINK (U3_U_WR_LINK#9.15)
FPGA-GPIO37: Main (R10.1), Connectors_GPIOs (J2.76), U_WR_LINK (U3_U_WR_LINK#9.14)
FPGA-GPIO38: Main (R8.1), Connectors_GPIOs (J2.78), U_WR_LINK (U3_U_WR_LINK#1.15), U_WR_LINK (U3_U_WR_LINK#2.15), U_WR_LINK (U3_U_WR_LINK#3.15), U_WR_LINK (U3_U_WR_LINK#4.15), U_WR_LINK (U3_U_WR_LINK#5.15), U_WR_LINK (U3_U_WR_LINK#6.15), U_WR_LINK (U3_U_WR_LINK#7.15), U_WR_LINK (U3_U_WR_LINK#8.15)
FPGA-GPIO39: Main (R9.2), Connectors_GPIOs (J2.80), U_WR_LINK (U3_U_WR_LINK#1.14), U_WR_LINK (U3_U_WR_LINK#2.14), U_WR_LINK (U3_U_WR_LINK#3.14), U_WR_LINK (U3_U_WR_LINK#4.14), U_WR_LINK (U3_U_WR_LINK#5.14), U_WR_LINK (U3_U_WR_LINK#6.14), U_WR_LINK (U3_U_WR_LINK#7.14), U_WR_LINK (U3_U_WR_LINK#8.14)
FPGA_RXD: Connector_GTX (J1.89), TEST_USB (IC8.2)
FPGA_TXD: Connector_GTX (J1.91), TEST_USB (IC8.10)
I2C_DL_SC0: I2C_Multiplexers (IC5.18), U_WR_LINK (J10_U_WR_LINK#1.5 R30_U_WR_LINK#1.1)
I2C_DL_SC1: I2C_Multiplexers (IC5.20), U_WR_LINK (J8_U_WR_LINK#1.5 R16_U_WR_LINK#1.1)
I2C_DL_SC2: I2C_Multiplexers (IC5.14), U_WR_LINK (J10_U_WR_LINK#2.5 R30_U_WR_LINK#2.1)
I2C_DL_SC3: I2C_Multiplexers (IC5.16), U_WR_LINK (J8_U_WR_LINK#2.5 R16_U_WR_LINK#2.1)
I2C_DL_SC4: I2C_Multiplexers (IC5.9), U_WR_LINK (J10_U_WR_LINK#3.5 R30_U_WR_LINK#3.1)
I2C_DL_SC5: I2C_Multiplexers (IC5.11), U_WR_LINK (J8_U_WR_LINK#3.5 R16_U_WR_LINK#3.1)
I2C_DL_SC6: I2C_Multiplexers (IC5.5), U_WR_LINK (J10_U_WR_LINK#4.5 R30_U_WR_LINK#4.1)
I2C_DL_SC7: I2C_Multiplexers (IC5.7), U_WR_LINK (J8_U_WR_LINK#4.5 R16_U_WR_LINK#4.1)
I2C_DL_SC8: I2C_Multiplexers (IC6.18), U_WR_LINK (J10_U_WR_LINK#5.5 R30_U_WR_LINK#5.1)
I2C_DL_SC9: I2C_Multiplexers (IC6.20), U_WR_LINK (J8_U_WR_LINK#5.5 R16_U_WR_LINK#5.1)
I2C_DL_SC10: I2C_Multiplexers (IC6.14), U_WR_LINK (J10_U_WR_LINK#6.5 R30_U_WR_LINK#6.1)
I2C_DL_SC11: I2C_Multiplexers (IC6.16), U_WR_LINK (J8_U_WR_LINK#6.5 R16_U_WR_LINK#6.1)
I2C_DL_SC12: I2C_Multiplexers (IC6.9), U_WR_LINK (J10_U_WR_LINK#7.5 R30_U_WR_LINK#7.1)
I2C_DL_SC13: I2C_Multiplexers (IC6.11), U_WR_LINK (J8_U_WR_LINK#7.5 R16_U_WR_LINK#7.1)
I2C_DL_SC14: I2C_Multiplexers (IC6.5), U_WR_LINK (J10_U_WR_LINK#8.5 R30_U_WR_LINK#8.1)
I2C_DL_SC15: I2C_Multiplexers (IC6.7), U_WR_LINK (J8_U_WR_LINK#8.5 R16_U_WR_LINK#8.1)
I2C_DL_SD0: I2C_Multiplexers (IC5.17), U_WR_LINK (J10_U_WR_LINK#1.4 R29_U_WR_LINK#1.1)
I2C_DL_SD1: I2C_Multiplexers (IC5.19), U_WR_LINK (J8_U_WR_LINK#1.4 R15_U_WR_LINK#1.1)
I2C_DL_SD2: I2C_Multiplexers (IC5.13), U_WR_LINK (J10_U_WR_LINK#2.4 R29_U_WR_LINK#2.1)
I2C_DL_SD3: I2C_Multiplexers (IC5.15), U_WR_LINK (J8_U_WR_LINK#2.4 R15_U_WR_LINK#2.1)
I2C_DL_SD4: I2C_Multiplexers (IC5.8), U_WR_LINK (J10_U_WR_LINK#3.4 R29_U_WR_LINK#3.1)
I2C_DL_SD5: I2C_Multiplexers (IC5.10), U_WR_LINK (J8_U_WR_LINK#3.4 R15_U_WR_LINK#3.1)
I2C_DL_SD6: I2C_Multiplexers (IC5.4), U_WR_LINK (J10_U_WR_LINK#4.4 R29_U_WR_LINK#4.1)
I2C_DL_SD7: I2C_Multiplexers (IC5.6), U_WR_LINK (J8_U_WR_LINK#4.4 R15_U_WR_LINK#4.1)
I2C_DL_SD8: I2C_Multiplexers (IC6.17), U_WR_LINK (J10_U_WR_LINK#5.4 R29_U_WR_LINK#5.1)
I2C_DL_SD9: I2C_Multiplexers (IC6.19), U_WR_LINK (J8_U_WR_LINK#5.4 R15_U_WR_LINK#5.1)
I2C_DL_SD10: I2C_Multiplexers (IC6.13), U_WR_LINK (J10_U_WR_LINK#6.4 R29_U_WR_LINK#6.1)
I2C_DL_SD11: I2C_Multiplexers (IC6.15), U_WR_LINK (J8_U_WR_LINK#6.4 R15_U_WR_LINK#6.1)
I2C_DL_SD12: I2C_Multiplexers (IC6.8), U_WR_LINK (J10_U_WR_LINK#7.4 R29_U_WR_LINK#7.1)
I2C_DL_SD13: I2C_Multiplexers (IC6.10), U_WR_LINK (J8_U_WR_LINK#7.4 R15_U_WR_LINK#7.1)
I2C_DL_SD14: I2C_Multiplexers (IC6.4), U_WR_LINK (J10_U_WR_LINK#8.4 R29_U_WR_LINK#8.1)
I2C_DL_SD15: I2C_Multiplexers (IC6.6), U_WR_LINK (J8_U_WR_LINK#8.4 R15_U_WR_LINK#8.1)
MGTRX112_0_N: Connector_GTX (J1.3), U_WR_LINK (J8_U_WR_LINK#1.12)
MGTRX112_0_P: Connector_GTX (J1.1), U_WR_LINK (J8_U_WR_LINK#1.13)
MGTRX112_1_N: Connector_GTX (J1.7), U_WR_LINK (J10_U_WR_LINK#1.12)
MGTRX112_1_P: Connector_GTX (J1.5), U_WR_LINK (J10_U_WR_LINK#1.13)
MGTRX112_2_N: Connector_GTX (J1.11), U_WR_LINK (J8_U_WR_LINK#2.12)
MGTRX112_2_P: Connector_GTX (J1.9), U_WR_LINK (J8_U_WR_LINK#2.13)
MGTRX112_3_N: Connector_GTX (J1.15), U_WR_LINK (J10_U_WR_LINK#2.12)
MGTRX112_3_P: Connector_GTX (J1.13), U_WR_LINK (J10_U_WR_LINK#2.13)
MGTRX113_0_N: Connector_GTX (J1.19), U_WR_LINK (J8_U_WR_LINK#3.12)
MGTRX113_0_P: Connector_GTX (J1.17), U_WR_LINK (J8_U_WR_LINK#3.13)
MGTRX113_1_N: Connector_GTX (J1.23), U_WR_LINK (J10_U_WR_LINK#3.12)
MGTRX113_1_P: Connector_GTX (J1.21), U_WR_LINK (J10_U_WR_LINK#3.13)
MGTRX113_2_N: Connector_GTX (J1.27), U_WR_LINK (J8_U_WR_LINK#4.12)
MGTRX113_2_P: Connector_GTX (J1.25), U_WR_LINK (J8_U_WR_LINK#4.13)
MGTRX113_3_N: Connector_GTX (J1.31), U_WR_LINK (J10_U_WR_LINK#4.12)
MGTRX113_3_P: Connector_GTX (J1.29), U_WR_LINK (J10_U_WR_LINK#4.13)
MGTRX114_0_N: Connector_GTX (J1.35), U_WR_LINK (J8_U_WR_LINK#5.12)
MGTRX114_0_P: Connector_GTX (J1.33), U_WR_LINK (J8_U_WR_LINK#5.13)
MGTRX114_1_N: Connector_GTX (J1.39), U_WR_LINK (J10_U_WR_LINK#5.12)
MGTRX114_1_P: Connector_GTX (J1.37), U_WR_LINK (J10_U_WR_LINK#5.13)
MGTRX114_2_N: Connector_GTX (J1.43), U_WR_LINK (J8_U_WR_LINK#6.12)
MGTRX114_2_P: Connector_GTX (J1.41), U_WR_LINK (J8_U_WR_LINK#6.13)
MGTRX114_3_N: Connector_GTX (J1.47), U_WR_LINK (J10_U_WR_LINK#6.12)
MGTRX114_3_P: Connector_GTX (J1.45), U_WR_LINK (J10_U_WR_LINK#6.13)
MGTRX115_0_N: Connector_GTX (J1.51), U_WR_LINK (J8_U_WR_LINK#7.12)
MGTRX115_0_P: Connector_GTX (J1.49), U_WR_LINK (J8_U_WR_LINK#7.13)
MGTRX115_1_N: Connector_GTX (J1.55), U_WR_LINK (J10_U_WR_LINK#7.12)
MGTRX115_1_P: Connector_GTX (J1.53), U_WR_LINK (J10_U_WR_LINK#7.13)
MGTRX115_2_N: Connector_GTX (J1.59), U_WR_LINK (J8_U_WR_LINK#8.12)
MGTRX115_2_P: Connector_GTX (J1.57), U_WR_LINK (J8_U_WR_LINK#8.13)
MGTRX115_3_N: Connector_GTX (J1.63), U_WR_LINK (J10_U_WR_LINK#8.12)
MGTRX115_3_P: Connector_GTX (J1.61), U_WR_LINK (J10_U_WR_LINK#8.13)
MGTRX116_0_N: Connector_GTX (J1.67), U_WR_LINK (J8_U_WR_LINK#9.12)
MGTRX116_0_P: Connector_GTX (J1.65), U_WR_LINK (J8_U_WR_LINK#9.13)
MGTRX116_1_N: Connector_GTX (J1.71), U_WR_LINK (J10_U_WR_LINK#9.12)
MGTRX116_1_P: Connector_GTX (J1.69), U_WR_LINK (J10_U_WR_LINK#9.13)
MGTTX112_0_N: Connector_GTX (J1.2), U_WR_LINK (J8_U_WR_LINK#1.19)
MGTTX112_0_P: Connector_GTX (J1.4), U_WR_LINK (J8_U_WR_LINK#1.18)
MGTTX112_1_N: Connector_GTX (J1.8), U_WR_LINK (J10_U_WR_LINK#1.19)
MGTTX112_1_P: Connector_GTX (J1.6), U_WR_LINK (J10_U_WR_LINK#1.18)
MGTTX112_2_N: Connector_GTX (J1.12), U_WR_LINK (J8_U_WR_LINK#2.19)
MGTTX112_2_P: Connector_GTX (J1.10), U_WR_LINK (J8_U_WR_LINK#2.18)
MGTTX112_3_N: Connector_GTX (J1.16), U_WR_LINK (J10_U_WR_LINK#2.19)
MGTTX112_3_P: Connector_GTX (J1.14), U_WR_LINK (J10_U_WR_LINK#2.18)
MGTTX113_0_N: Connector_GTX (J1.20), U_WR_LINK (J8_U_WR_LINK#3.19)
MGTTX113_0_P: Connector_GTX (J1.18), U_WR_LINK (J8_U_WR_LINK#3.18)
MGTTX113_1_N: Connector_GTX (J1.24), U_WR_LINK (J10_U_WR_LINK#3.19)
MGTTX113_1_P: Connector_GTX (J1.22), U_WR_LINK (J10_U_WR_LINK#3.18)
MGTTX113_2_N: Connector_GTX (J1.28), U_WR_LINK (J8_U_WR_LINK#4.19)
MGTTX113_2_P: Connector_GTX (J1.26), U_WR_LINK (J8_U_WR_LINK#4.18)
MGTTX113_3_N: Connector_GTX (J1.32), U_WR_LINK (J10_U_WR_LINK#4.19)
MGTTX113_3_P: Connector_GTX (J1.30), U_WR_LINK (J10_U_WR_LINK#4.18)
MGTTX114_0_N: Connector_GTX (J1.36), U_WR_LINK (J8_U_WR_LINK#5.19)
MGTTX114_0_P: Connector_GTX (J1.34), U_WR_LINK (J8_U_WR_LINK#5.18)
MGTTX114_1_N: Connector_GTX (J1.40), U_WR_LINK (J10_U_WR_LINK#5.19)
MGTTX114_1_P: Connector_GTX (J1.38), U_WR_LINK (J10_U_WR_LINK#5.18)
MGTTX114_2_N: Connector_GTX (J1.44), U_WR_LINK (J8_U_WR_LINK#6.19)
MGTTX114_2_P: Connector_GTX (J1.42), U_WR_LINK (J8_U_WR_LINK#6.18)
MGTTX114_3_N: Connector_GTX (J1.48), U_WR_LINK (J10_U_WR_LINK#6.19)
MGTTX114_3_P: Connector_GTX (J1.46), U_WR_LINK (J10_U_WR_LINK#6.18)
MGTTX115_0_N: Connector_GTX (J1.52), U_WR_LINK (J8_U_WR_LINK#7.19)
MGTTX115_0_P: Connector_GTX (J1.50), U_WR_LINK (J8_U_WR_LINK#7.18)
MGTTX115_1_N: Connector_GTX (J1.56), U_WR_LINK (J10_U_WR_LINK#7.19)
MGTTX115_1_P: Connector_GTX (J1.54), U_WR_LINK (J10_U_WR_LINK#7.18)
MGTTX115_2_N: Connector_GTX (J1.60), U_WR_LINK (J8_U_WR_LINK#8.19)
MGTTX115_2_P: Connector_GTX (J1.58), U_WR_LINK (J8_U_WR_LINK#8.18)
MGTTX115_3_N: Connector_GTX (J1.64), U_WR_LINK (J10_U_WR_LINK#8.19)
MGTTX115_3_P: Connector_GTX (J1.62), U_WR_LINK (J10_U_WR_LINK#8.18)
MGTTX116_0_N: Connector_GTX (J1.68), U_WR_LINK (J8_U_WR_LINK#9.19)
MGTTX116_0_P: Connector_GTX (J1.66), U_WR_LINK (J8_U_WR_LINK#9.18)
MGTTX116_1_N: Connector_GTX (J1.72), U_WR_LINK (J10_U_WR_LINK#9.19)
MGTTX116_1_P: Connector_GTX (J1.70), U_WR_LINK (J10_U_WR_LINK#9.18)